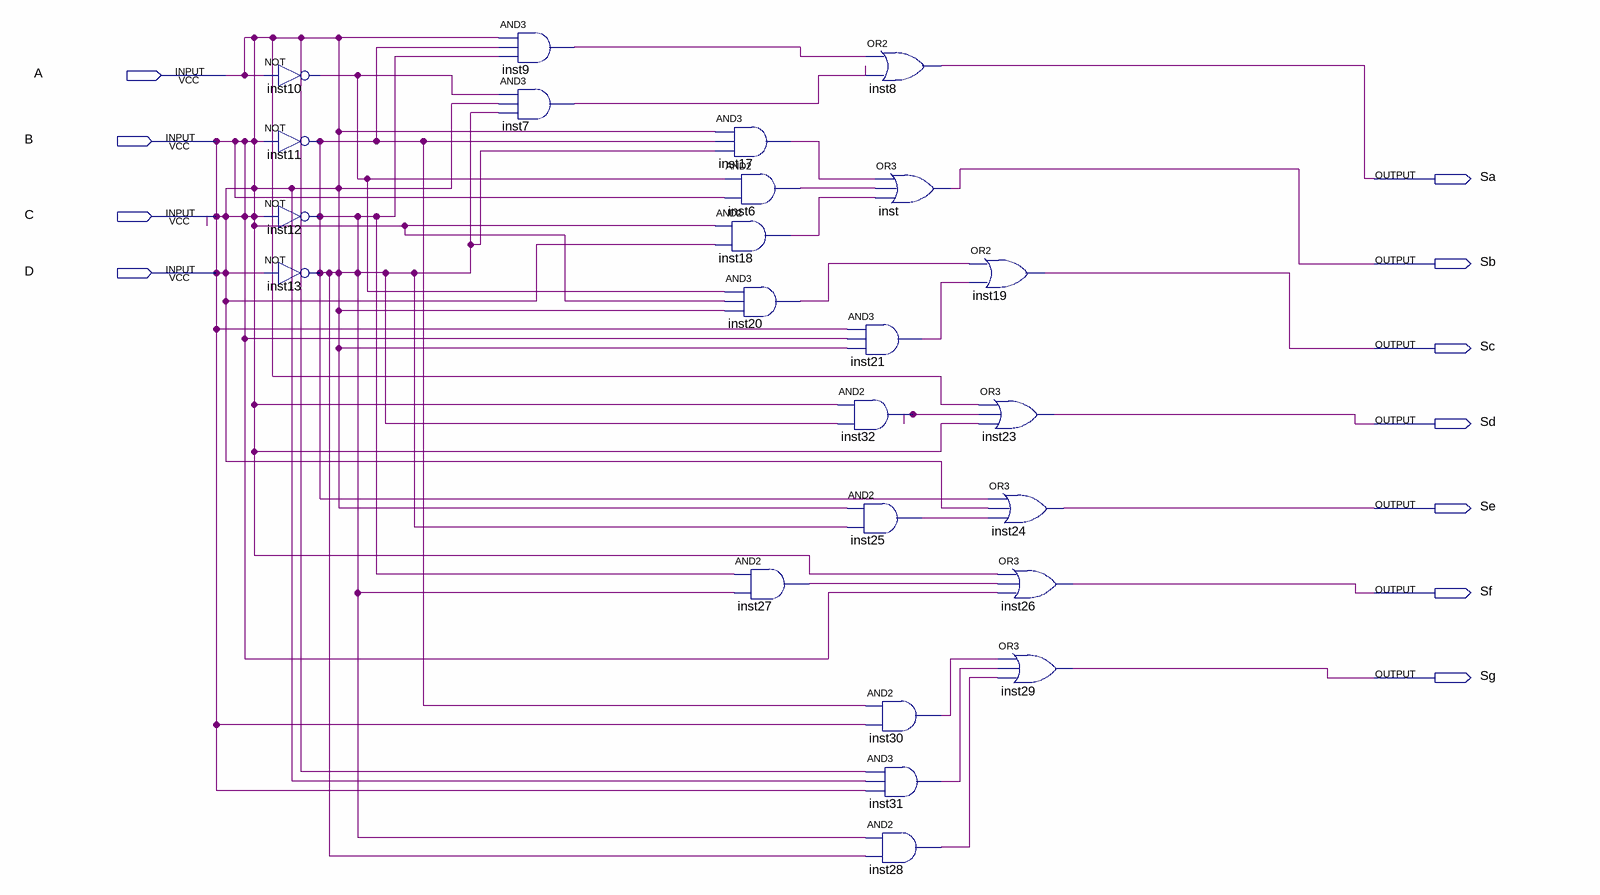
[diagram p0: schematic sheet]
// Quartus schematic trabalho.bdf as structural Verilog: 24 symbols, 11 pins
module trabalho (
  input  A,
  input  B,
  input  C,
  input  D,
  output Sa,
  output Sb,
  output Sc,
  output Sd,
  output Se,
  output Sf,
  output Sg
);

  wire inst6_out, inst7_out, inst9_out, inst10_out, inst17_out, inst18_out, inst20_out, inst21_out,
       inst25_out, inst27_out, inst28_out, inst30_out, inst31_out, inst32_out;

  not inst10 (inst10_out, A);
  not inst11 (A, A);
  not inst12 (A, A);
  not inst13 (A, A);
  and inst9 (inst9_out, A, A, A);
  and inst7 (inst7_out, inst10_out, A, A);
  and inst17 (inst17_out, A, A, A);
  and inst6 (inst6_out, inst10_out, A);
  and inst18 (inst18_out, A, A);
  and inst20 (inst20_out, inst10_out, A, A);
  and inst27 (inst27_out, A, A);
  or inst8 (Sa, inst9_out, inst7_out);
  or inst (Sb, inst17_out, inst6_out, inst18_out);
  and inst21 (inst21_out, A, A, A);
  and inst32 (inst32_out, A, A);
  and inst25 (inst25_out, A, A);
  and inst30 (inst30_out, A, A);
  and inst31 (inst31_out, A, A, A);
  and inst28 (inst28_out, A, A);
  or inst19 (Sc, inst20_out, inst21_out);
  or inst23 (Sd, A, inst32_out, A);
  or inst24 (Se, A, A, inst25_out);
  or inst26 (Sf, A, inst27_out, A);
  or inst29 (Sg, inst30_out, inst31_out, inst28_out);

  assign B = A;
  assign C = A;
  assign D = A;
endmodule
